# EAGLE design StoneMouse (EAGLE 7.6.0)
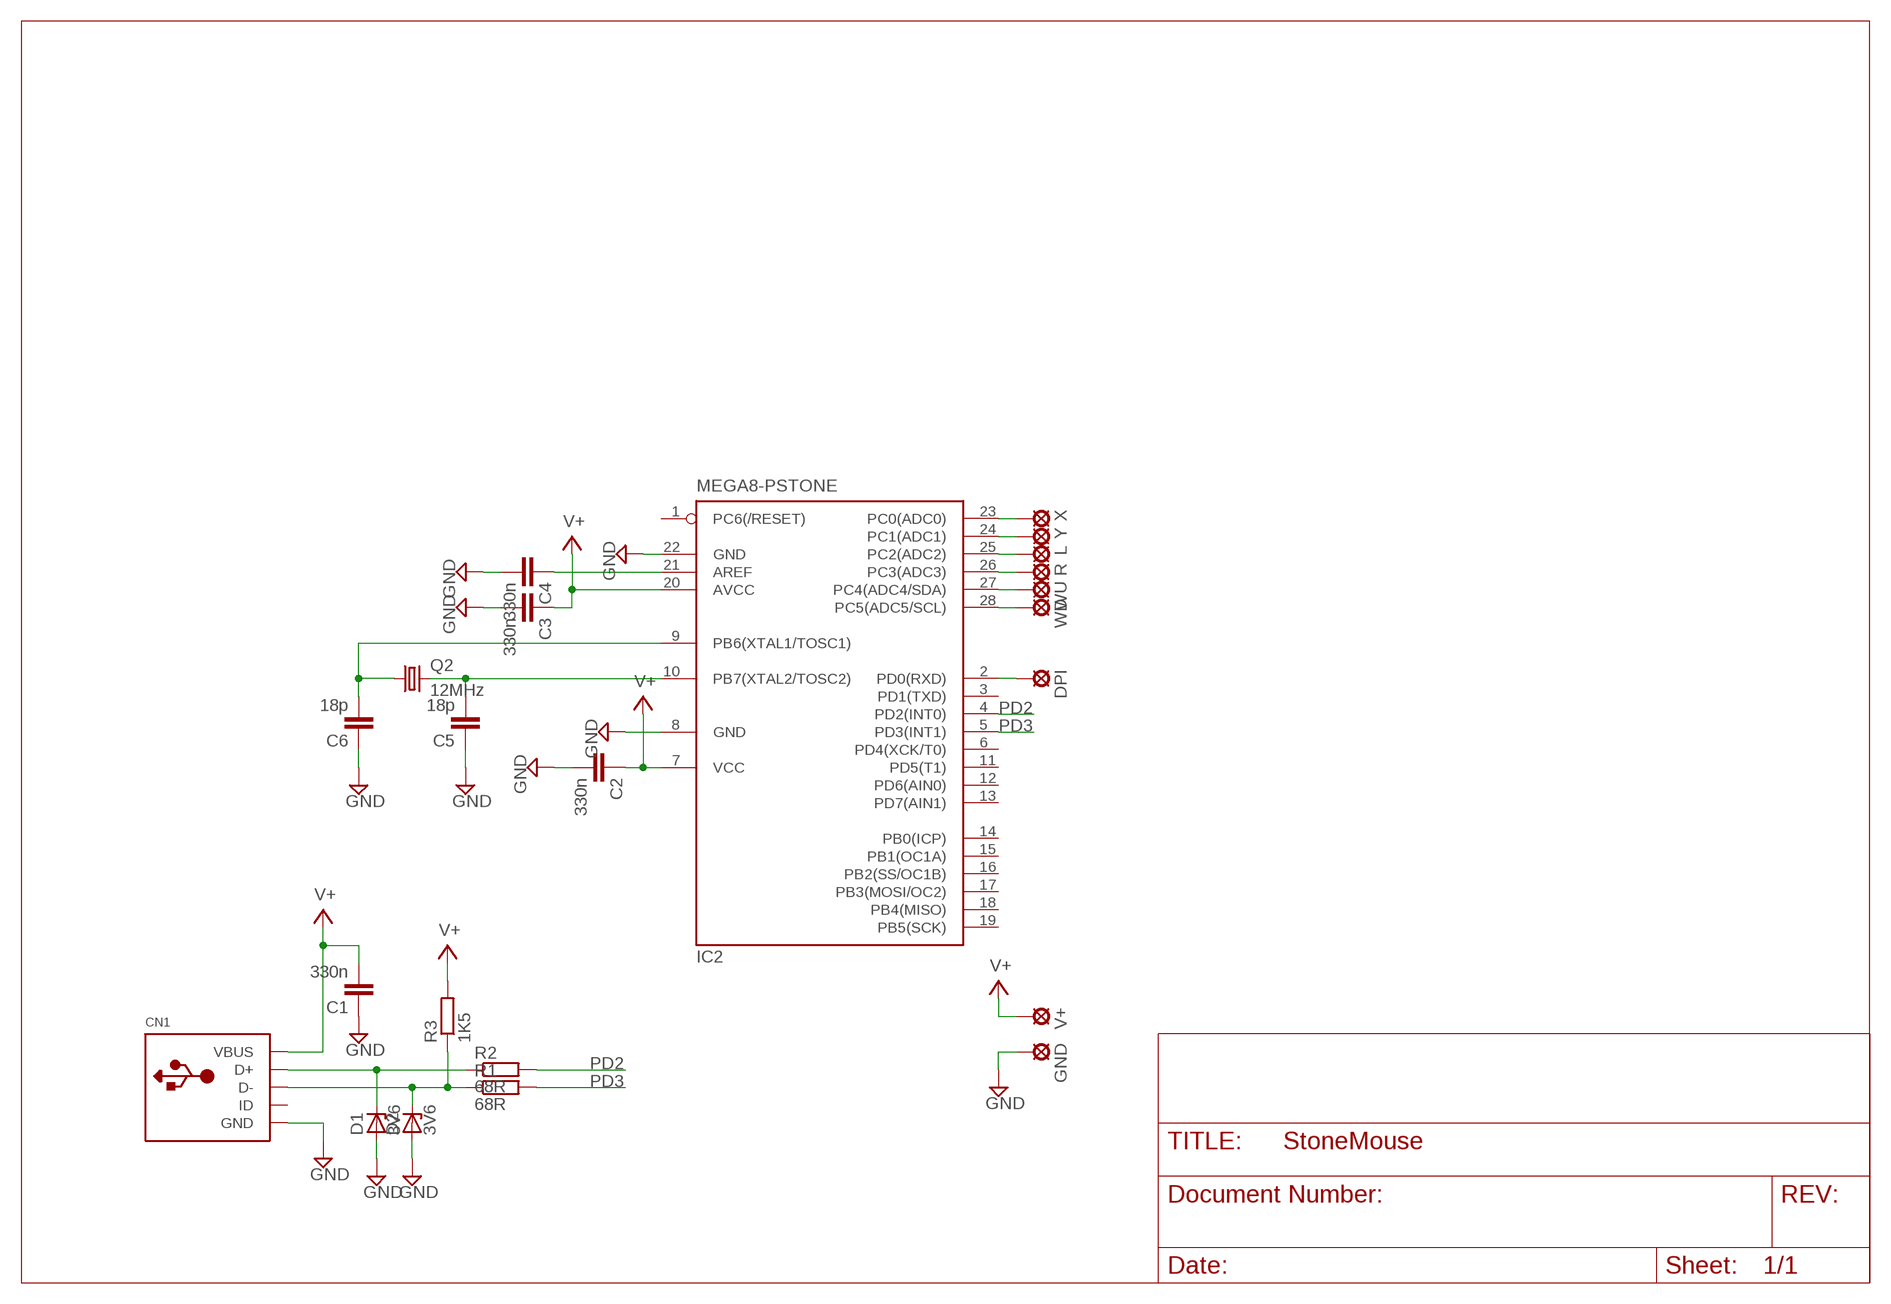
[diagram p0: schematic, sheet 1]

## Parts
C1  330n  C-EUSTONESMD  [3X7_STONESMD]
C2  330n  C-EUSTONESMD  [3X7_STONESMD]
C3  330n  C-EUSTONESMD  [3X7_STONESMD]
C4  330n  C-EUSTONESMD  [3X7_STONESMD]
C5  18p  C-EUSTONESMD  [3X7_STONESMD]
C6  18p  C-EUSTONESMD  [3X7_STONESMD]
CN1  USBMINIB  [USB-MINIB]
D1  3V6  BZX85STONESMD  [DO35-7_STONESMD]
D2  3V6  BZX85STONESMD  [DO35-7_STONESMD]
DPI  SMD3X6  [SMD3X6]
GND  SMD3X6  [SMD3X6]
IC2  MEGA8-PSTONE  [DIL28-3_STONESMD]
L  SMD3X6  [SMD3X6]
Q2  12MHz  CRYSTALSM49  [SM49]
R  SMD3X6  [SMD3X6]
R1  68R  R-EU_STONESMD  [0204/7_STONESMD]
R2  68R  R-EU_STONESMD  [0204/7_STONESMD]
R3  1K5  R-EU_STONESMD  [0204/7_STONESMD]
V+  SMD3X6  [SMD3X6]
WD  SMD3X6  [SMD3X6]
WU  SMD3X6  [SMD3X6]
X  SMD3X6  [SMD3X6]
Y  SMD3X6  [SMD3X6]

## Nets
GND: C1.P$1 C2.P$2 C3.P$2 C4.P$2 C5.P$1 C6.P$1 CN1.GND D1.A D2.A GND.P$1(MP) IC2.8(GND) IC2.22(GND)
N$1: CN1.D+ D1.K(C) R2.P$1
N$2: CN1.D- D2.K(C) R1.P$1 R3.P$1
N$3: C4.P$1 IC2.21(AREF)
N$5: DPI.P$1(MP) IC2.2(PD0(RXD))
N$6: C6.P$2 IC2.9(PB6(XTAL1/TOSC1)) Q2.1
N$7: C5.P$2 IC2.10(PB7(XTAL2/TOSC2)) Q2.2
N$8: IC2.24(PC1(ADC1)) Y.P$1(MP)
N$9: IC2.23(PC0(ADC0)) X.P$1(MP)
N$10: IC2.25(PC2(ADC2)) L.P$1(MP)
N$11: IC2.26(PC3(ADC3)) R.P$1(MP)
N$12: IC2.27(PC4(ADC4/SDA)) WU.P$1(MP)
N$13: IC2.28(PC5(ADC5/SCL)) WD.P$1(MP)
PD2: IC2.4(PD2(INT0)) R2.P$2
PD3: IC2.5(PD3(INT1)) R1.P$2
V+: C1.P$2 C2.P$1 C3.P$1 CN1.VBUS IC2.7(VCC) IC2.20(AVCC) R3.P$2 V+.P$1(MP)
Unconnected: CN1.ID IC2.1(PC6(/RESET)) IC2.3(PD1(TXD)) IC2.6(PD4(XCK/T0)) IC2.11(PD5(T1)) IC2.12(PD6(AIN0)) IC2.13(PD7(AIN1)) IC2.14(PB0(ICP)) IC2.15(PB1(OC1A)) IC2.16(PB2(SS/OC1B)) IC2.17(PB3(MOSI/OC2)) IC2.18(PB4(MISO)) IC2.19(PB5(SCK))

## Library data of the parts
C1-C6 = rcl:C-EU: CAPACITOR, European symbol
CN1 = adafruit:USB: USB Connectors USBMINIB - Surface Mount Female Mini-B USB Connector [Part No.] 4UConnector: 06564 By microbuilder.eu
D1 D2 = diode:BZX85: Z DIODE
DPI GND L R V+ WD WU X Y = solpad:SMD3X6
IC2 = atmel:MEGA8-P: MICROCONTROLLER 8 Kbytes FLASH, 1 kbytes SRAM, 512 bytes EEPROM, USART, 4-channel 10 bit ADC, 2-channel 8 bit ADC Pin compatible with Atmega48, ATMega88, ATMega168 Source: avr.lbr
Q2 = crystal:CRYSTAL: CRYSTAL; OC_FARNELL: unknown; OC_NEWARK: unknown
R1-R3 = rcl:R-EU_: RESISTOR, European symbol

## Board
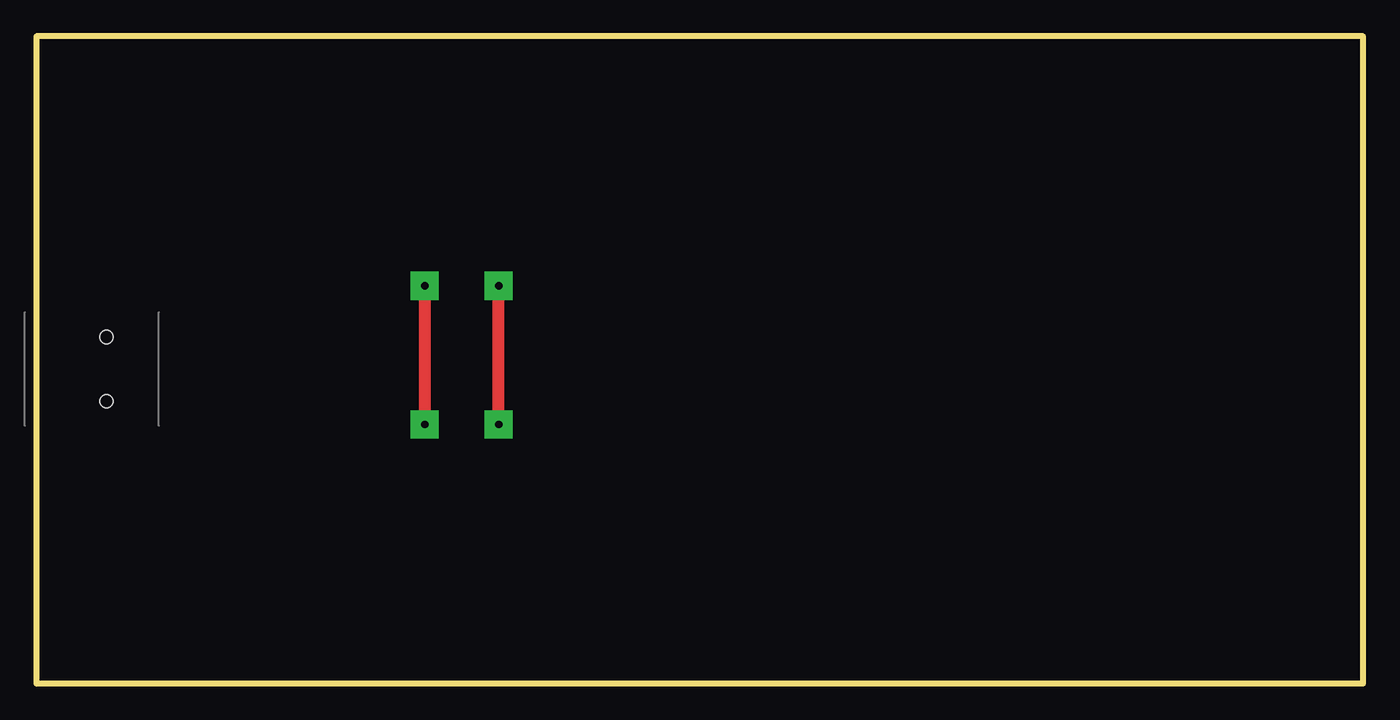
[diagram p1: board, top side]
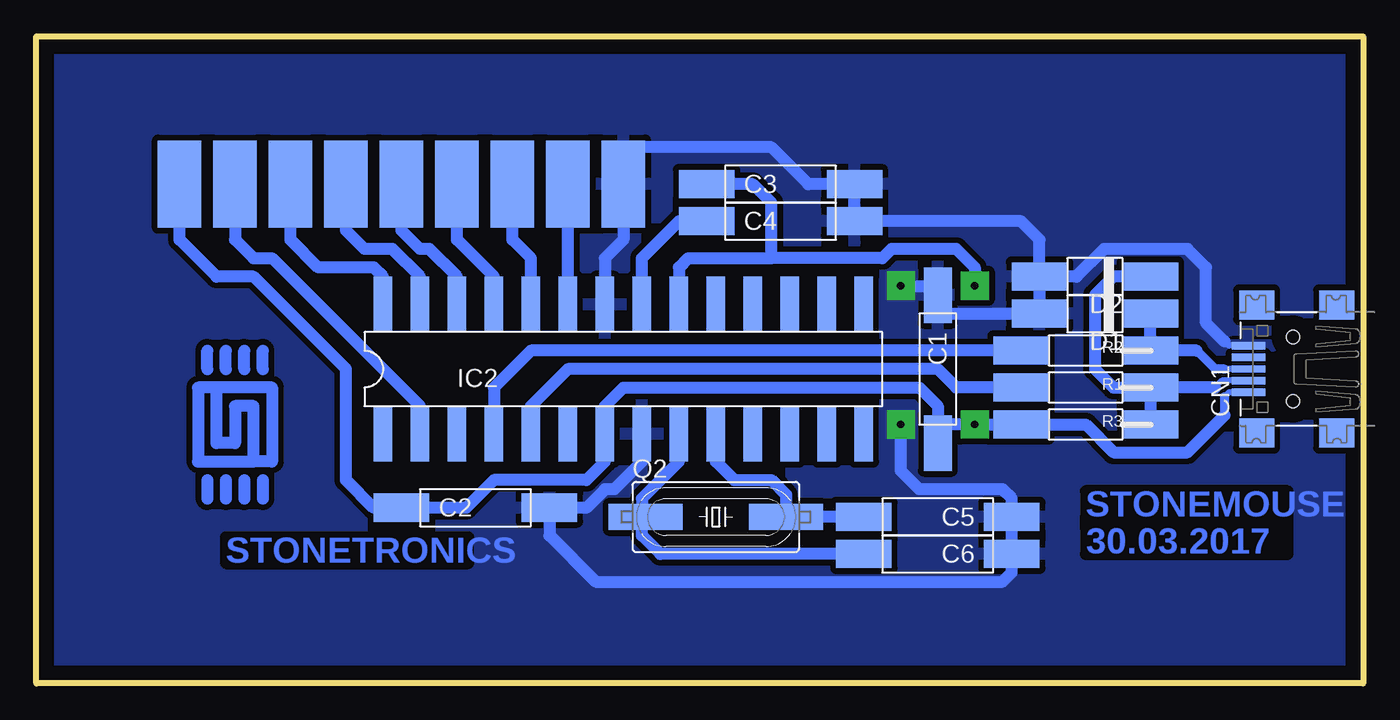
[diagram p2: board, bottom side, seen from below]

Size 91.11 x 44.44 mm. Coordinates in mm from the lower left corner, seen from the top.
Outline: 0,0 91.11,0 91.11,44.44 0,44.44 0,0
Copper layers (1*16): Top 0.035mm / dielectric 1.5mm / Bottom 0.035mm
Design rules "stonetronics": minimum track width 10mil, minimum drill 24mil, track to track 16mil, track to pad 16mil, pad to pad 16mil, via to via 16mil, smd to smd 8mil, copper to edge 40mil, drill to drill 8mil, minimum pad ring 10mil, minimum via ring 8mil, stop-mask expansion 4mil, vias tented up to drill 0mil, thermal gap 16mil

### Footprints (pad centres in the part's own frame; a part is rotated, then mirrored left to right if it is on the bottom)
3X7_STONESMD = smd 3.81 x 1.93: P$1 -3.81,0; P$2 6.35,0
USB-MINIB = smd 0.5 x 2.308: D+ 0,4.064; D- -0.8,4.064; GND 1.6,4.064; ID 0.8,4.064; VBUS -1.6,4.064 | smd 2 x 2.4: GND1 -4.4,-2; GND2 -4.4,3.5; GND3 4.4,3.5; GND4 4.4,-2 | hole 0.9: -2.2,1; 2.2,1
DO35-7_STONESMD = smd 3.81 x 1.93: A 3.81,0; K -3.81,0
SMD3X6 = smd 3 x 6 bottom: P$1 0,0
DIL28-3_STONESMD = smd 1.27 x 3.81: 1 1.27,-1.27; 2 3.81,-1.27; 3 6.35,-1.27; 4 8.89,-1.27; 5 11.43,-1.27; 6 13.97,-1.27; 7 16.51,-1.27; 8 19.05,-1.27; 9 21.59,-1.27; 10 24.13,-1.27; 11 26.67,-1.27; 12 29.21,-1.27; 13 31.75,-1.27; 14 34.29,-1.27; 15 34.29,7.62; 16 31.75,7.62; 17 29.21,7.62; 18 26.67,7.62; 19 24.13,7.62; 20 21.59,7.62; 21 19.05,7.62; 22 16.51,7.62; 23 13.97,7.62; 24 11.43,7.62; 25 8.89,7.62; 26 6.35,7.62; 27 3.81,7.62; 28 1.27,7.62
SM49 = smd 5.08 x 1.778: 1 -4.826,0; 2 4.826,0
0204/7_STONESMD = smd 3.81 x 1.93: P$1 -4.445,0; P$2 4.445,0

### Placement (x,y rotation side)
C1  29.21,22.86 270 bottom
C2  62.23,12.06 0 bottom
C3  41.27,34.29 0 bottom
C4  41.27,31.75 0 bottom
C5  27.94,11.43 180 bottom
C6  27.94,8.89 180 bottom
CN1  3.81,21.59 90 bottom
D1  18.41,25.4 180 bottom
D2  18.41,27.94 180 bottom
DPI  77.47,34.29 0 top
GND  50.8,34.29 0 top
IC2  68.58,18.41 0 bottom
L  62.23,34.29 0 top
Q2  44.45,11.43 0 bottom
R  66.04,34.29 0 top
R1  19.05,20.32 180 bottom
R2  19.05,22.86 180 bottom
R3  19.05,17.78 180 bottom
V+  81.28,34.29 0 top
WD  73.66,34.29 0 top
WU  69.85,34.29 0 top
X  54.61,34.29 0 top
Y  58.42,34.29 0 top

### Tracks (layer width: path | path; a pad name or v marks a point on that pad's centre or on a via)
GND  (via drill 0.5 pad 1.93)
  Top 0.813: v31.75,17.78 v31.75,27.3
  Bottom 0.406: CN1.GND 9.22,23.19 9.53,23.5
  Bottom 0.813: 9.53,23.5 10.79,24.77 10.79,28.57 12.06,29.84 17.78,29.84 19.68,27.94 D2.A | D2.A D1.A 29.21,25.4 C1.P$1 | IC2.8 49.53,15.24 51.44,13.34 52.07,13.34 53.34,12.06 C2.P$2 55.88,10.16 52.7,6.99 24.77,6.99 24.13,7.62 C6.P$1 C5.P$1 24.13,12.7 24.77,13.34 30.48,13.34 31.75,14.61 v31.75,17.78 | D2.A 22.23,30.48 23.5,31.75 C4.P$2 C3.P$2 38.1,34.29 40.64,36.83 50.8,36.83 GND.P$1 50.8,30.48 52.07,29.21 IC2.22 | C1.P$1 29.21,27.94 | v31.75,27.3 29.21,27.3 C1.P$1
  pour Bottom: 0,44.45 91.44,44.45 91.44,0 0,0
N$1
  Bottom 0.406: CN1.D+ 9.53,21.59
  Bottom 0.61: 9.53,21.59 10.16,21.59 11.43,22.86
  Bottom 0.813: D1.K R2.P$1 11.43,22.86
N$2
  Bottom 0.406: CN1.D- 9.69,20.79 10.16,20.32
  Bottom 0.813: D2.K 17.14,27.94 18.41,26.67 18.41,21.59 17.14,20.32 R1.P$1 | R1.P$1 R3.P$1 | 10.16,20.32 R1.P$1
N$3
  Bottom 0.813: IC2.21 49.53,29.21 46.99,31.75 C4.P$1
N$5
  Bottom 0.813: DPI.P$1 77.47,30.48 76.2,29.21 74.93,29.21 64.77,19.05 IC2.2
N$6
  Bottom 0.813: IC2.9 46.99,15.24 49.53,12.7 49.53,11.43 | 49.53,11.43 Q2.1 | C6.P$2 48.26,8.89 49.53,10.16 49.53,11.43
N$7
  Bottom 0.813: C5.P$2 Q2.2 39.62,12.95 40.64,13.97 43.18,13.97 44.45,15.24 IC2.10
N$8
  Bottom 0.813: IC2.24 57.15,29.21 58.42,30.48 Y.P$1
N$9
  Bottom 0.813: IC2.23 X.P$1 54.61,35.56
N$10
  Bottom 0.813: IC2.25 59.69,27.94 62.23,30.48 L.P$1
N$11
  Bottom 0.813: IC2.26 62.23,27.94 64.14,29.84 64.77,29.84 66.04,31.11 R.P$1
N$12
  Bottom 0.813: IC2.27 64.77,27.94 66.67,29.84 68.58,29.84 69.85,31.11 WU.P$1
N$13
  Bottom 0.813: IC2.28 67.31,27.94 67.94,28.57 71.75,28.57 73.66,30.48 WD.P$1
N$14
  Bottom 0.813: 78.74,20.32 74.93,20.32 74.93,15.24 76.2,15.24 | 78.74,20.32 80.01,20.32 80.01,15.24 76.2,15.24 | 76.2,15.24 76.2,19.05 77.47,19.05 77.47,16.51 78.74,16.51 78.74,20.32
N$15
  Bottom 0.813: 75.56,21.59 75.56,22.86
N$16
  Bottom 0.813: 76.83,21.59 76.83,22.86
N$17
  Bottom 0.813: 78.11,21.59 78.11,22.86
N$18
  Bottom 0.813: 79.38,21.59 79.38,22.86
N$19
  Bottom 0.813: 75.56,13.97 75.56,12.7
N$20
  Bottom 0.813: 76.83,13.97 76.83,12.7
N$21
  Bottom 0.813: 78.11,13.97 78.11,12.7
N$22
  Bottom 0.813: 79.38,13.97 79.38,12.7
PD2
  Bottom 0.813: R2.P$2 57.15,22.86 59.69,20.32 IC2.4
PD3
  Bottom 0.813: IC2.5 57.15,19.05 54.61,21.59 29.21,21.59 27.94,20.32 R1.P$2
V+  (via drill 0.5 pad 1.93)
  Top 0.813: v26.67,27.3 v26.67,17.78
  Bottom 0.406: CN1.VBUS 9.22,19.99 9.53,19.68
  Bottom 0.61: 9.53,19.68 9.53,18.41
  Bottom 0.813: 9.53,18.41 12.06,15.88 17.14,15.88 19.05,17.78 R3.P$2 v26.67,17.78 29.21,17.78 | 40.64,29.21 40.64,33.02 41.91,34.29 C3.P$1 | 29.21,15.24 C1.P$2 29.21,17.78 | v26.67,27.3 26.67,28.57 27.94,29.84 32.38,29.84 33.02,29.21 40.64,29.21 | 29.21,17.78 29.21,19.05 30.48,20.32 50.8,20.32 52.07,19.05 IC2.7 52.07,15.24 53.34,13.97 59.69,13.97 61.59,12.06 C2.P$1 67.94,12.06 69.85,13.97 69.85,21.59 76.2,27.94 78.74,27.94 81.28,30.48 V+.P$1 | IC2.20 46.99,28.57 46.35,29.21 40.64,29.21

### Text on the board
Bottom: STONEMOUSE | 30.03.2017 | STONETRONICS